# EAGLE schematic HP85disk_03 (EAGLE 9.2.2)

## Sheet 1 of 2
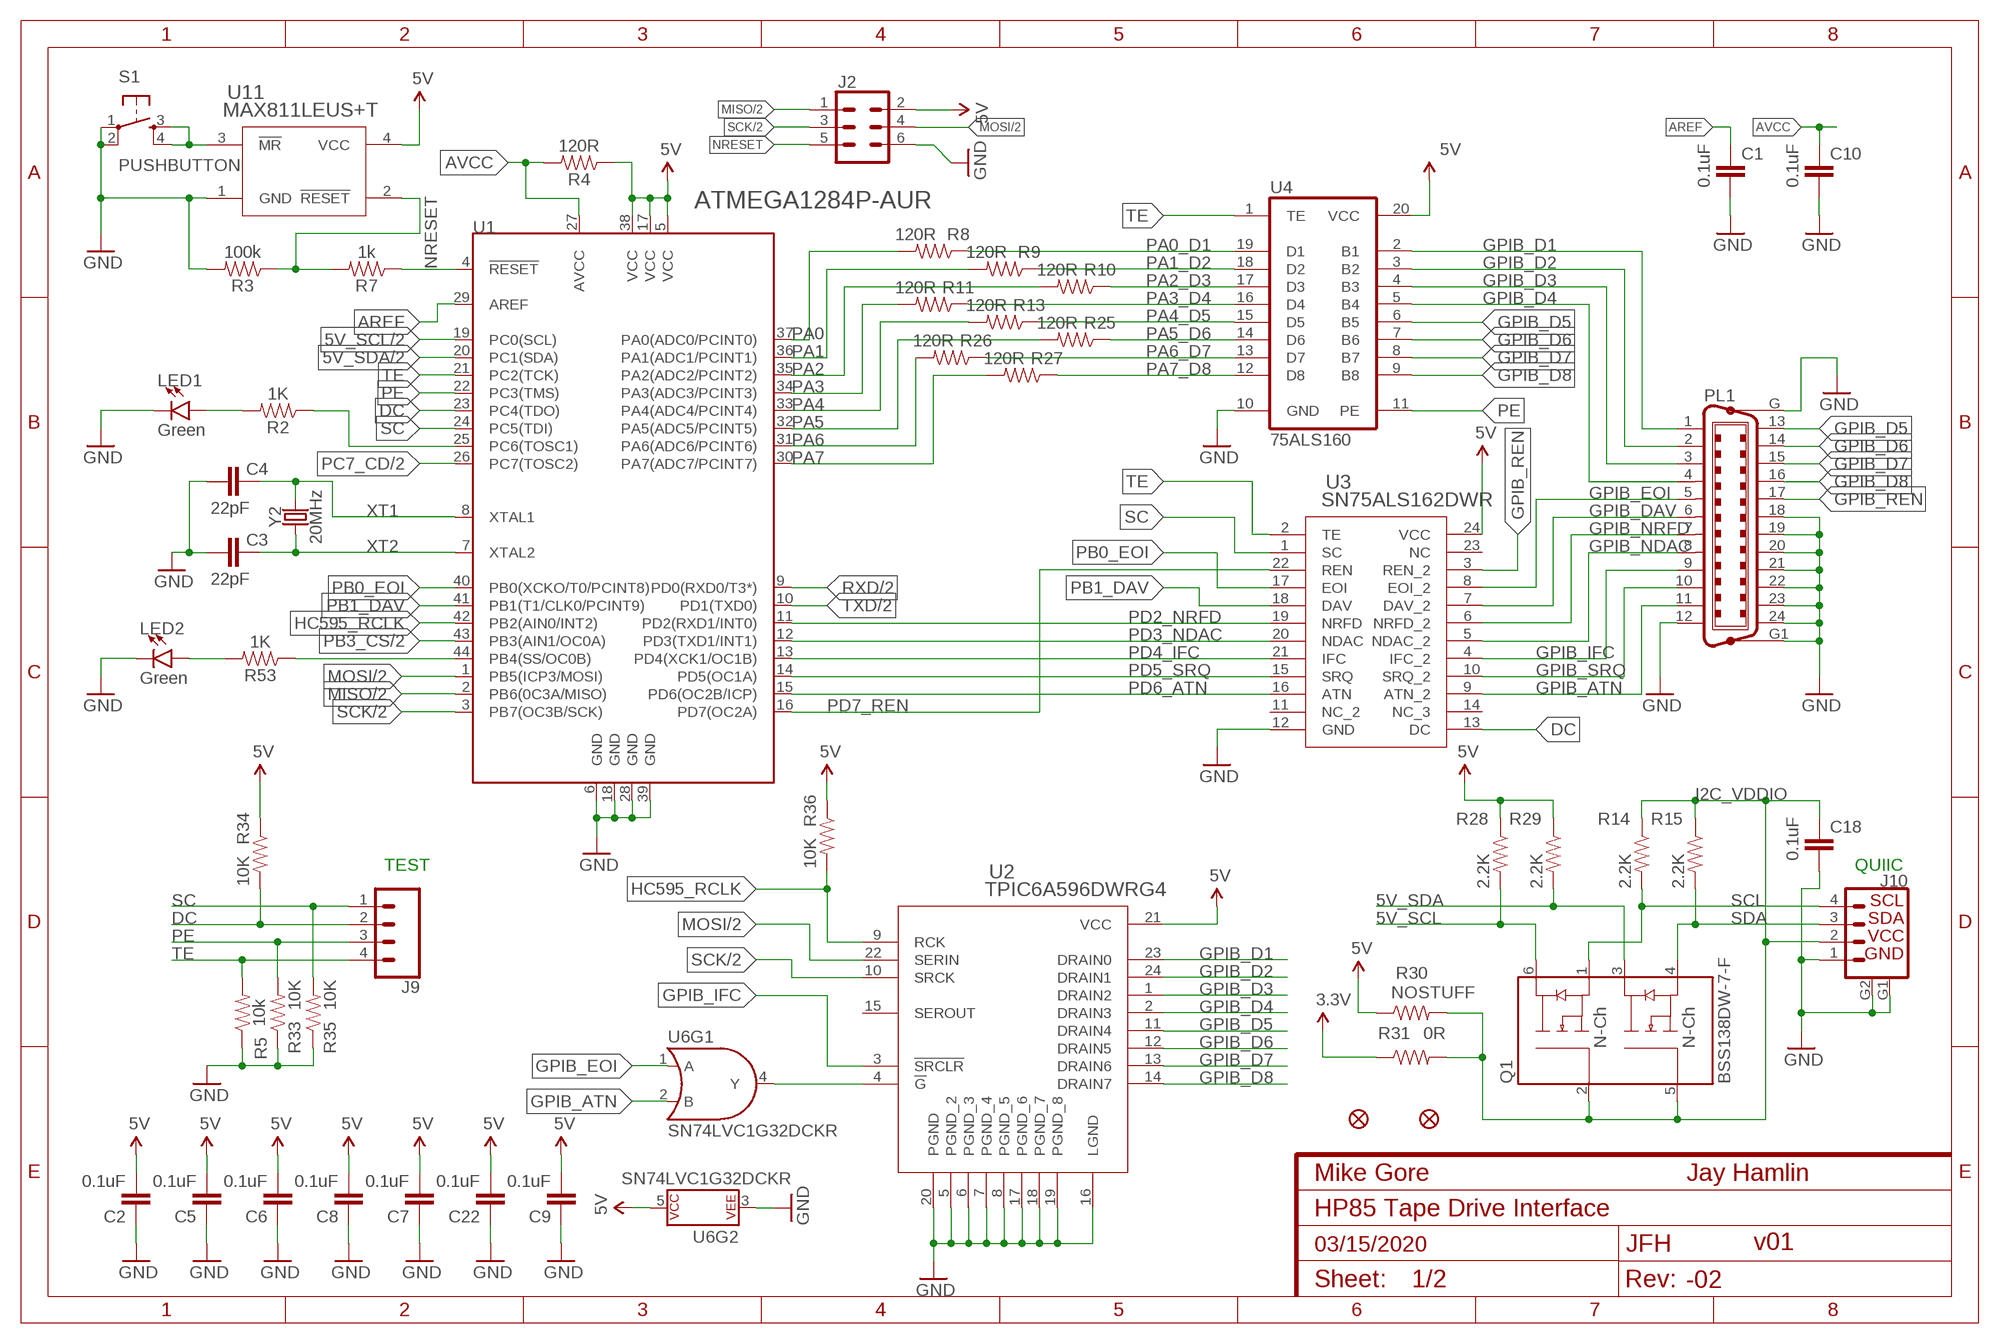
[diagram p0: schematic, sheet 1]

### Parts
C1  0.1uF  0.1UF-0603-25V-(+80/-20%)  [0603]
C2  0.1uF  0.1UF-0603-25V-(+80/-20%)  [0603]
C3  22pF  0.1UF-0603-25V-(+80/-20%)  [0603]
C4  22pF  0.1UF-0603-25V-(+80/-20%)  [0603]
C5  0.1uF  0.1UF-0603-25V-(+80/-20%)  [0603]
C6  0.1uF  0.1UF-0603-25V-(+80/-20%)  [0603]
C7  0.1uF  0.1UF-0603-25V-(+80/-20%)  [0603]
C8  0.1uF  0.1UF-0603-25V-(+80/-20%)  [0603]
C9  0.1uF  0.1UF-0603-25V-(+80/-20%)  [0603]
C10  0.1uF  0.1UF-0603-25V-(+80/-20%)  [0603]
C18  0.1uF  0.1UF-0603-25V-(+80/-20%)  [0603]
C22  0.1uF  0.1UF-0603-25V-(+80/-20%)  [0603]
J2  CONN_03X2_BIGPADSFEMALE_SMD  [2X3_SMD]
J9  CONN_041.27MM  [1X04_1.27MM]
J10  QWIIC_CONNECTORJS-1MM  [QUIIC_1X04_1MM_RA]
JP8  FIDUCIAL1X2  [FIDUCIAL-1X2]
JP9  FIDUCIAL1X2  [FIDUCIAL-1X2]
LED1  Green  LED1206  [LED-1206]
LED2  Green  LED1206  [LED-1206]
PL1  C24HP  [24HP]
Q1  BSS138DW-7-F  [SOT-363]
R2  1K  4.7KOHM-0603-1/10W-1%  [0603]
R3  100k  10KOHM-0603-1/10W-1%  [0603]
R4  120R  10KOHM-0603-1/10W-1%  [0603]
R5  10k  10KOHM-0603-1/10W-1%  [0603]
R7  1k  10KOHM-0603-1/10W-1%  [0603]
R8  120R  10KOHM-0603-1/10W-1%  [0603]
R9  120R  10KOHM-0603-1/10W-1%  [0603]
R10  120R  10KOHM-0603-1/10W-1%  [0603]
R11  120R  10KOHM-0603-1/10W-1%  [0603]
R13  120R  10KOHM-0603-1/10W-1%  [0603]
R14  2.2K  10KOHM-0603-1/10W-1%  [0603]
R15  2.2K  10KOHM-0603-1/10W-1%  [0603]
R25  120R  10KOHM-0603-1/10W-1%  [0603]
R26  120R  10KOHM-0603-1/10W-1%  [0603]
R27  120R  10KOHM-0603-1/10W-1%  [0603]
R28  2.2K  10KOHM-0603-1/10W-1%  [0603]
R29  2.2K  10KOHM-0603-1/10W-1%  [0603]
R30  NOSTUFF  10KOHM-0603-1/10W-1%  [0603]
R31  0R  10KOHM-0603-1/10W-1%  [0603]
R33  10K  10KOHM-0603-1/10W-1%  [0603]
R34  10K  10KOHM-0603-1/10W-1%  [0603]
R35  10K  10KOHM-0603-1/10W-1%  [0603]
R36  10K  10KOHM-0603-1/10W-1%  [0603]
R53  1K  4.7KOHM-0603-1/10W-1%  [0603]
S1  PUSHBUTTON  SWITCH_SPST_4_PINSQUARE  [TACTILE-SWITCH-SMD]
U1  ATMEGA1284P-AUR  ATMEGA1284AUTQFP-44  [TQFP44]
U2  TPIC6A596DWRG4  [DW24]
U3  SN75ALS162DWR  [DW24]
U4  75ALS160  75160SO  [SO20L]
U6  SN74LVC1G32DCKR  74LVC32DBV  [SOT23-5]
U11  MAX811LEUS+T  MAX811TEUS+T  [21-0052F]
Y2  20MHz  CRYSTAL-16MHZSMD-5X3.2  [CRYSTAL-SMD-5X3.2-4PAD]

### Nets
3.3V: R31.1 ; also sheet 2
5V: C2.2 C5.2 C6.2 C7.2 C8.2 C9.2 C22.2 J2.2 R4.1 R28.1 R29.1 R30.1 R34.1 R36.1 U1.5(VCC) U1.17(VCC) U1.38(VCC) U2.21(VCC) U3.24(VCC) U4.20(VCC) U6.5(P$V+) U11.4(VCC) ; also sheet 2
5V_SCL: Q1.6(D1) R28.2 U1.19(PC0(SCL)) ; also sheet 2
5V_SDA: Q1.3(D2) R29.2 U1.20(PC1(SDA)) ; also sheet 2
AREF: C1.1 U1.29(AREF)
AVCC: C10.1 R4.2 U1.27(AVCC)
DC: J9.2 R34.2 U1.23(PC4(TDO)) U3.13(DC)
GND: C1.2 C2.1 C3.1 C4.1 C5.1 C6.1 C7.1 C8.1 C9.1 C10.2 C18.2 C22.1 J2.6 J10.1 J10.G1 J10.G2 LED1.C LED2.C PL1.12 PL1.18 PL1.19 PL1.20 PL1.21 PL1.22 PL1.23 PL1.24 PL1.G PL1.G1 R3.2 R5.1 R33.1 R35.1 S1.1 S1.2 U1.6(GND) U1.18(GND) U1.28(GND) U1.39(GND) U2.5(PGND_2) U2.6(PGND_3) U2.7(PGND_4) U2.8(PGND_5) U2.16(LGND) U2.17(PGND_6) U2.18(PGND_7) U2.19(PGND_8) U2.20(PGND) U3.12(GND) U4.10(GND) U6.3(P$V-) U11.1(GND) ; also sheet 2
GPIB_ATN: PL1.11 U3.9(ATN_2) U6.2(B)
GPIB_D1: PL1.1 U2.23(DRAIN0) U4.2(B1)
GPIB_D2: PL1.2 U2.24(DRAIN1) U4.3(B2)
GPIB_D3: PL1.3 U2.1(DRAIN2) U4.4(B3)
GPIB_D4: PL1.4 U2.2(DRAIN3) U4.5(B4)
GPIB_D5: PL1.13 U2.11(DRAIN4) U4.6(B5)
GPIB_D6: PL1.14 U2.12(DRAIN5) U4.7(B6)
GPIB_D7: PL1.15 U2.13(DRAIN6) U4.8(B7)
GPIB_D8: PL1.16 U2.14(DRAIN7) U4.9(B8)
GPIB_DAV: PL1.6 U3.7(DAV_2)
GPIB_EOI: PL1.5 U3.8(EOI_2) U6.1(A)
GPIB_IFC: PL1.9 U2.3(!SRCLR) U3.4(IFC_2)
GPIB_NDAC: PL1.8 U3.5(NDAC_2)
GPIB_NRFD: PL1.7 U3.6(NRFD_2)
GPIB_REN: PL1.17 U3.3(REN_2)
GPIB_SRQ: PL1.10 U3.10(SRQ_2)
HC595_RCLK: R36.2 U1.42(PB2(AIN0/INT2)) U2.9(RCK)
I2C_VDDIO: C18.1 J10.2 Q1.2(G1) Q1.5(G2) R14.1 R15.1 R30.2 R31.2
MISO: J2.1 U1.2(PB6(0C3A/MISO)) ; also sheet 2
MOSI: J2.4 U1.1(PB5(ICP3/MOSI)) U2.22(SERIN) ; also sheet 2
N$2: R2.1 U1.25(PC6(TOSC1))
N$6: U2.4(!G) U6.4(Y)
N$8: S1.3 S1.4 U11.3(!MR)
N$10: R53.1 U1.44(PB4(SS/OC0B))
N$12: R3.1 R7.2 U11.2(!RESET)
N$21: LED1.A R2.2
N$22: LED2.A R53.2
NRESET: J2.5 R7.1 U1.4(!RESET)
PA0: R8.2 U1.37(PA0(ADC0/PCINT0))
PA0_D1: R8.1 U4.19(D1)
PA1: R9.2 U1.36(PA1(ADC1/PCINT1))
PA1_D2: R9.1 U4.18(D2)
PA2: R10.2 U1.35(PA2(ADC2/PCINT2))
PA2_D3: R10.1 U4.17(D3)
PA3: R11.2 U1.34(PA3(ADC3/PCINT3))
PA3_D4: R11.1 U4.16(D4)
PA4: R13.2 U1.33(PA4(ADC4/PCINT4))
PA4_D5: R13.1 U4.15(D5)
PA5: R25.2 U1.32(PA5(ADC5/PCINT5))
PA5_D6: R25.1 U4.14(D6)
PA6: R26.2 U1.31(PA6(ADC6/PCINT6))
PA6_D7: R26.1 U4.13(D7)
PA7: R27.2 U1.30(PA7(ADC7/PCINT7))
PA7_D8: R27.1 U4.12(D8)
PB0_EOI: U1.40(PB0(XCKO/T0/PCINT8)) U3.17(EOI)
PB1_DAV: U1.41(PB1(T1/CLK0/PCINT9)) U3.18(DAV)
PB3_CS: U1.43(PB3(AIN1/OC0A)) ; also sheet 2
PC7_CD: U1.26(PC7(TOSC2)) ; also sheet 2
PD2_NRFD: U1.11(PD2(RXD1/INT0)) U3.19(NRFD)
PD3_NDAC: U1.12(PD3(TXD1/INT1)) U3.20(NDAC)
PD4_IFC: U1.13(PD4(XCK1/OC1B)) U3.21(IFC)
PD5_SRQ: U1.14(PD5(OC1A)) U3.15(SRQ)
PD6_ATN: U1.15(PD6(OC2B/ICP)) U3.16(ATN)
PD7_REN: U1.16(PD7(OC2A)) U3.22(REN)
PE: J9.3 R33.2 U1.22(PC3(TMS)) U4.11(PE)
RXD: U1.9(PD0(RXD0/T3*)) ; also sheet 2
SC: J9.1 R35.2 U1.24(PC5(TDI)) U3.1(SC)
SCK: J2.3 U1.3(PB7(OC3B/SCK)) U2.10(SRCK) ; also sheet 2
SCL: J10.4 Q1.1(S1) R14.2
SDA: J10.3 Q1.4(S2) R15.2
TE: J9.4 R5.2 U1.21(PC2(TCK)) U3.2(TE) U4.1(TE)
TXD: U1.10(PD1(TXD0)) ; also sheet 2
XT1: C4.2 U1.8(XTAL1) Y2.3
XT2: C3.2 U1.7(XTAL2) Y2.1
Unconnected: U2.15(SEROUT) U3.11(NC_2) U3.14(NC_3) U3.23(NC)

### Notes on the sheet
- TEST | QUIIC
- v01

## Sheet 2 of 2
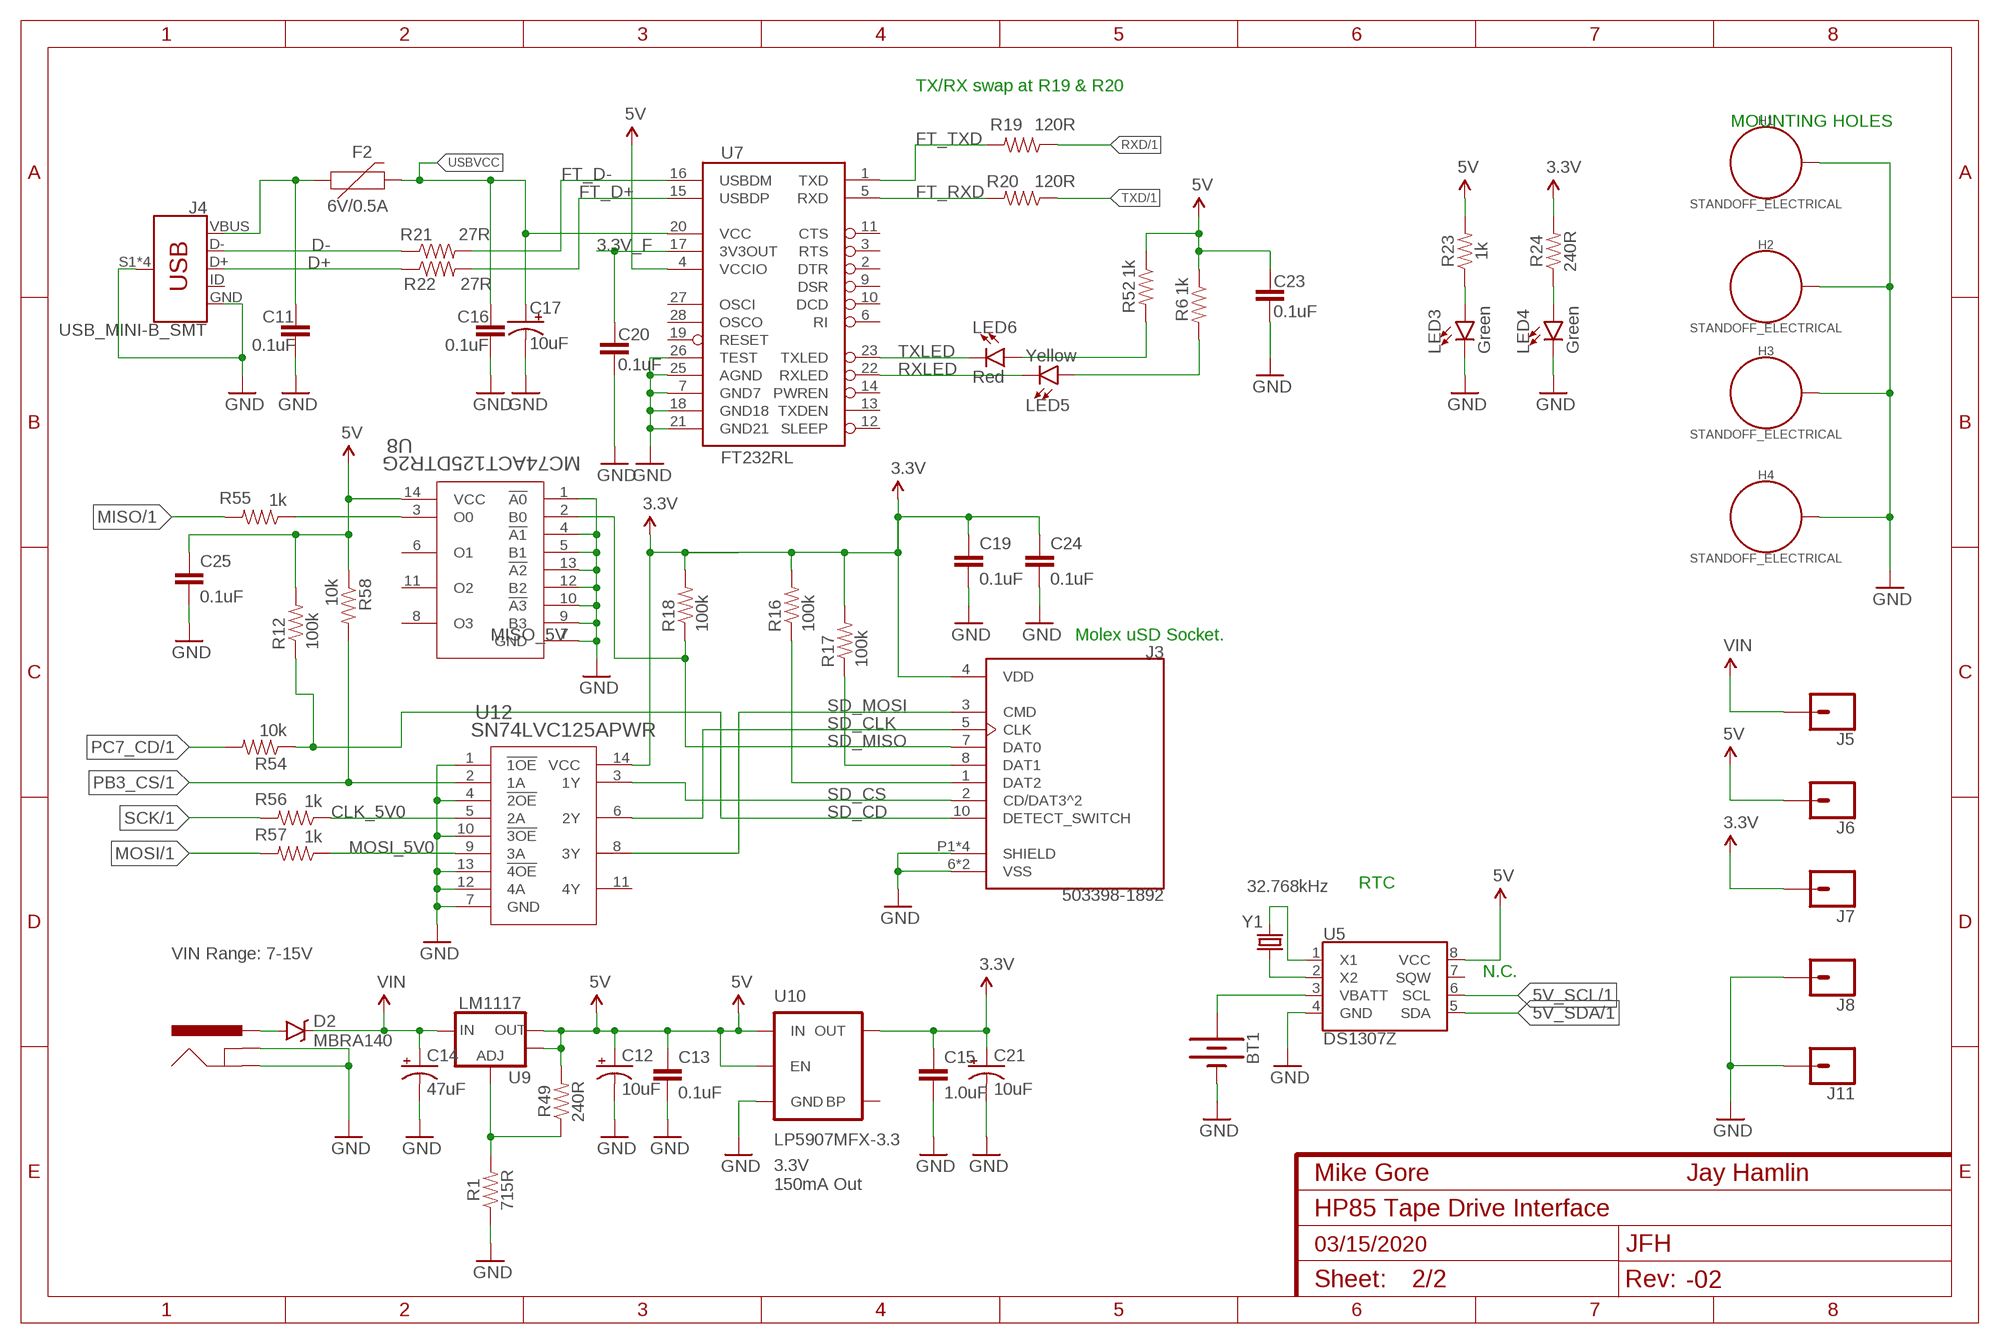
[diagram p1: schematic, sheet 2]

### Parts
BT1  BATTERY-12MM_PTH  [BATTCON_12MM_PTH]
C11  0.1uF  0.1UF-0603-25V-(+80/-20%)  [0603]
C12  10uF  10UF-POLAR-EIA3216-16V-10%(TANT)  [EIA3216]
C13  0.1uF  0.1UF-0603-25V-(+80/-20%)  [0603]
C14  47uF  47UF-POLAR-PANASONIC_D-35V-20%  [PANASONIC_D]
C15  1.0uF  1.0UF-0603-16V-10%  [0603]
C16  0.1uF  0.1UF-0603-25V-(+80/-20%)  [0603]
C17  10uF  10UF-POLAR-EIA3216-16V-10%(TANT)  [EIA3216]
C19  0.1uF  0.1UF-0603-25V-(+80/-20%)  [0603]
C20  0.1uF  0.1UF-0603-25V-(+80/-20%)  [0603]
C21  10uF  10UF-POLAR-EIA3216-16V-10%(TANT)  [EIA3216]
C23  0.1uF  0.1UF-0603-25V-(+80/-20%)  [0603]
C24  0.1uF  0.1UF-0603-25V-(+80/-20%)  [0603]
C25  0.1uF  0.1UF-0603-25V-(+80/-20%)  [0603]
D2  MBRA140  [SMA-DIODE]
F2  6V/0.5A  PTC-HALF_AMP  [1206]
H1  STANDOFF_ELECTRICAL  [STANDOFF-ELECTRICAL]
H2  STANDOFF_ELECTRICAL  [STANDOFF-ELECTRICAL]
H3  STANDOFF_ELECTRICAL  [STANDOFF-ELECTRICAL]
H4  STANDOFF_ELECTRICAL  [STANDOFF-ELECTRICAL]
J1  POWER_JACKSUPER_BOMB_DIGITY  [POWER_JACK_SMD_OVERPASTE_SUPER_BOMB_DIGITY]
J3  503398-1892  [MOLEX_503398-1892]
J4  USB_MINI-B_SMT  [USB-MINIB]
J5  CONN_01  [1X01]
J6  CONN_01  [1X01]
J7  CONN_01  [1X01]
J8  CONN_01  [1X01]
J11  CONN_01  [1X01]
LED3  Green  LED1206  [LED-1206]
LED4  Green  LED1206  [LED-1206]
LED5  Yellow  LED1206  [LED-1206]
LED6  Red  LED1206  [LED-1206]
R1  715R  715OHM-0603-1/10W-1%  [0603]
R6  1k  1KOHM-0603-1/10W-1%  [0603]
R12  100k  100KOHM-1/10W-1%(0603)  [0603-RES]
R16  100k  100KOHM-1/10W-1%(0603)  [0603-RES]
R17  100k  100KOHM-1/10W-1%(0603)  [0603-RES]
R18  100k  100KOHM-1/10W-1%(0603)  [0603-RES]
R19  120R  1KOHM-0603-1/10W-1%  [0603]
R20  120R  1KOHM-0603-1/10W-1%  [0603]
R21  27R  27OHM-0603-1/10W-1%  [0603]
R22  27R  27OHM-0603-1/10W-1%  [0603]
R23  1k  4.7KOHM-0603-1/10W-1%  [0603]
R24  240R  4.7KOHM-0603-1/10W-1%  [0603]
R49  240R  240OHM-0603-1/10W-1%  [0603]
R52  1k  1KOHM-0603-1/10W-1%  [0603]
R54  10k  100KOHM-1/10W-1%(0603)  [0603-RES]
R55  1k  100KOHM-1/10W-1%(0603)  [0603-RES]
R56  1k  100KOHM-1/10W-1%(0603)  [0603-RES]
R57  1k  100KOHM-1/10W-1%(0603)  [0603-RES]
R58  10k  100KOHM-1/10W-1%(0603)  [0603-RES]
U5  DS1307Z  [SO08-0.15]
U7  FT232RL  FT232RLSSOP  [SSOP28DB]
U8  MC74ACT125DTR2G  [TSSOP14_4P50X5P10]
U9  LM1117  V_REG_LM1117ALT1  [SOT223-ALT1]
U10  LP5907MFX-3.3  MIC52053.3V  [SOT23-5]
U12  SN74LVC125APWR  [PW14]
Y1  32.768kHz  CRYSTAL-32.768KHZSMD-2X6  [CRYSTAL-SMD-2X6-CYL]

### Nets
3.3V: C15.1 C19.1 C21.+ C24.1 J3.4(VDD) J7.1 R16.2 R17.2 R18.2 R24.2 U10.5(OUT) U12.14(VCC) ; also sheet 1
3.3V_F: C20.1 U7.17(3V3OUT)
5V: C12.+ C13.1 C23.1 C25.1 J6.1 R6.1 R12.2 R23.2 R49.2 R52.1 R58.1 U5.8(VCC) U7.4(VCCIO) U8.14(VCC) U9.2(OUT) U9.4(OUT) U10.1(IN) U10.3(EN) ; also sheet 1
5V_SCL: U5.6(SCL) ; also sheet 1
5V_SDA: U5.5(SDA) ; also sheet 1
CLK_5V0: R56.1 U12.5(2A)
D+: J4.D+ R22.1
D-: J4.D- R21.1
FT_D+: R22.2 U7.15(USBDP)
FT_D-: R21.2 U7.16(USBDM)
FT_RXD: R20.2 U7.5(RXD)
FT_TXD: R19.2 U7.1(TXD)
GND: BT1.GND(-) C11.2 C12.- C13.2 C14.- C15.2 C16.2 C17.- C19.2 C20.2 C21.- C23.2 C24.2 C25.2 H1.P1 H2.P1 H3.P1 H4.P1 J1.GND(GNDBREAK) J1.P$4(GND) J3.6(VSS) J3.9(VSS) J3.P1(SHIELD) J3.P2(SHIELD) J3.P3(SHIELD) J3.P4(SHIELD) J4.GND J4.S1(SHIELD) J4.S2(SHIELD) J4.S3(SHIELD) J4.S4(SHIELD) J8.1 J11.1 LED3.C LED4.C R1.1 U5.4(GND) U7.7(GND7) U7.18(GND18) U7.21(GND21) U7.25(AGND) U7.26(TEST) U8.1(!A0) U8.4(!A1) U8.5(B1) U8.7(GND) U8.9(B3) U8.10(!A3) U8.12(B2) U8.13(!A2) U10.2(GND) U12.1(!1OE) U12.4(!2OE) U12.7(GND) U12.10(!3OE) U12.12(4A) U12.13(!4OE) ; also sheet 1
MISO: R55.2 ; also sheet 1
MISO_5V: R55.1 U8.3(O0)
MOSI: R57.2 ; also sheet 1
MOSI_5V0: R57.1 U12.9(3A)
N$1: R1.2 R49.1 U9.1(ADJ)
N$5: LED6.A R52.2
N$7: LED3.A R23.1
N$9: LED5.A R6.2
N$11: J3.8(DAT1) R17.1
N$13: J3.1(DAT2) R16.1
N$16: U5.1(X1) Y1.X2
N$17: BT1.VCC@1(+) U5.3(VBATT)
N$18: U5.2(X2) Y1.X1
N$19: LED4.A R24.1
PB3_CS: R58.2 U12.2(1A) ; also sheet 1
PC7_CD: R54.2 ; also sheet 1
PWRIN1: D2.A J1.VIN0(PWR)
RXD: R19.1 ; also sheet 1
RXLED: LED5.C U7.22(RXLED)
SCK: R56.2 ; also sheet 1
SD_CD: J3.10(DETECT_SWITCH) R12.1 R54.1
SD_CLK: J3.5(CLK) U12.6(2Y)
SD_CS: J3.2(CD/DAT3^2) U12.3(1Y)
SD_MISO: J3.7(DAT0) R18.1 U8.2(B0)
SD_MOSI: J3.3(CMD) U12.8(3Y)
TXD: R20.1 ; also sheet 1
TXLED: LED6.C U7.23(TXLED)
USBVCC: C16.1 C17.+ F2.2 U7.20(VCC)
VIN: C14.+ D2.C J5.1 U9.3(IN)
VUSB1: C11.1 F2.1 J4.VBUS
Unconnected: J4.ID U5.7(SQW) U7.2(DTR) U7.3(RTS) U7.6(RI) U7.9(DSR) U7.10(DCD) U7.11(CTS) U7.12(SLEEP) U7.13(TXDEN) U7.14(PWREN) U7.19(RESET) U7.27(OSCI) U7.28(OSCO) U8.6(O1) U8.8(O3) U8.11(O2) U10.4(BP) U12.11(4Y)

### Notes on the sheet
- TX/RX swap at R19 & R20
- MOUNTING HOLES
- Molex uSD Socket.
- RTC
- VIN Range: 7-15V
- N.C.
- 3.3V
  150mA Out

## Library data of the parts
BT1 = SparkFun-Batteries:BATTERY: Battery - Single Cell A variety of battery chemistries, sizes, and footprints. Device List: 20MM_PTH - Coin Cell Battery Holder - 20mm (PTH) <https://www.sparkfun.com/products/783> 12MM_SMD - Coin Cell Battery Holder - 12mm (SMD) <https://www.sparkfun.com/products/10592> 12MM_PTH - Coin Cell Battery Holder - 12mm (PTH) <https://www.sparkfun.com/products/7948> 20MM_SMD - 20mm Coin Cell Battery Holder (SMD) (2 legs) Used on the Big Time Watch Kit <https://www.sparkfun.com/products/11734> 20MM_SMD_4LEGS - Coin Cell Battery Holder - 20mm (SMD) <https://www.sparkfun.com/products/11892> 20MM_SMD_4LEGS_OVERPASTE - Coin Cell Battery Holder - 20mm (SMD) <https://www.sparkfun.com/products/11892> (Over-paste on the legs) 24.5MM_PTH - Coin Cell Battery Holder - 24.5mm (PTH) <https://www.sparkfun.com/products/8863> 9V - 9V Battery Holder - PC Mount Used on the SparkFun SparkPunk Sound Kit <https://www.sparkfun.com/products/11177> and SparkFun SparkPunk Sequencer Kit <https://www.sparkfun.com/products/12707> 18650 - Battery Holder - 18650 (PTH) <https://www.sparkfun.com/products/13113> AA - Battery Holder - 1xAA (PTH) <https://www.sparkfun.com/products/7949> AAA - Battery Holder - 1xAAA (PTH) <https://www.sparkfun.com/products/12718> AA_KIT - Battery Holder - 1xAA (PTH) <https://www.sparkfun.com/products/7949> Special kit package - pads only have exposed copper on one side of the board. AAA_KIT - Battery Holder - 1xAAA (PTH) <https://www.sparkfun.com/products/12718> Special kit package - pads only have exposed copper on one side of the board.; PROD_ID: BATT-08315; SF_SKU: PRT-07948
C1 C9-C11 C13 C16 C18-C20 C22-C25 = SparkFun-Capacitors:0.1UF: 0.1µF ceramic capacitors A capacitor is a passive two-terminal electrical component used to store electrical energy temporarily in an electric field.; PROD_ID: CAP-00810
C2 C5-C8 = SparkFun-Capacitors:0.1UF: 0.1µF ceramic capacitors A capacitor is a passive two-terminal electrical component used to store electrical energy temporarily in an electric field.; PROD_ID: CAP-00810; SPICEPREFIX: C
C3 C4 = SparkFun-Capacitors:0.1UF: 0.1µF ceramic capacitors A capacitor is a passive two-terminal electrical component used to store electrical energy temporarily in an electric field.; PROD_ID: CAP-00810; VALUE: 0.1uF
C12 C17 C21 = SparkFun-Capacitors:10UF-POLAR: 10.0µF polarized capacitors A capacitor is a passive two-terminal electrical component used to store electrical energy temporarily in an electric field.; PROD_ID: CAP-00811
C14 = SparkFun-Capacitors:47UF-POLAR: 47µF polarized capacitors A capacitor is a passive two-terminal electrical component used to store electrical energy temporarily in an electric field.; PROD_ID: CAP-08478
C15 = SparkFun-Capacitors:1.0UF: 1µF ceramic capacitors A capacitor is a passive two-terminal electrical component used to store electrical energy temporarily in an electric field.; PROD_ID: CAP-00868
D2 = SparkFun-DiscreteSemi:MBRA140: 40V, 1A Schottky rectifier SMA/DO-214AC package DIO-08053; PROD_ID: DIO-08053
F2 = SparkFun-Fuses:PTC: Resettable Fuse PTC Resettable Fuse. Really a resistor with a postive temperature coefficient who's resistance increases dramatically with an increase in temperature. When heated by the power passing through the resistance rises causing the current to be limited, protecting the circuit. When a PTC cools back down it resumes conducting letting the circuit turn back on.; PROD_ID: RES-08585
H1-H4 = SparkFun-Hardware:STANDOFF_ELECTRICAL: Stand Off Drill holes with an electrical connection. For example, use these to ground your board to a chassis. Example SparkFun Products Screw - Phillips Head (1/4", 4-40, 10 pack) <https://www.sparkfun.com/products/10453> (PRT-10453) Screw - Phillips Head (1/2", 4-40, 10 pack) <https://www.sparkfun.com/products/10452> (PRT-10452) Screw - Phillips Head (3/4", 4-40, 10 pack) <https://www.sparkfun.com/products/10451> (PRT-10451) Screw - Phillips Head (1", 4-40, 10 pack) <https://www.sparkfun.com/products/10450> (PRT-10450)
J1 = Testing:POWER_JACK: Power Jack This is the standard 5.5mm barrel jack for power. The PTH is the most common, proven, reliable, footprint. All others are experimental. The Slot footprint only works if the mill layer is transmitted to the PCB fab house so be warned. Spark Fun Electronics SKU : PRT-00119. Mating wall wart : TOL-00298 (and others); PROD_ID: CONN-08106
J2 = JaysOWL_Library:CONN_03X2_BIGPADS: Multi connection point. Often used as Generic Header-pin footprint for 0.1 inch spaced/style header connections You can populate with any combo of single row headers, but if you'd like an exact match, check these: Header - 2x3 (Male, 0.1") <https://www.sparkfun.com/products/12807> (PRT-12807) Header - 2x3 (Female, 0.1") <https://www.sparkfun.com/products/13010> (PRT-13010) 2x3 Pin Shrouded Header <https://www.sparkfun.com/products/10877> (PRT-10877) On any of the 0.1 inch spaced packages, you can populate with these: Break Away Headers - Straight <https://www.sparkfun.com/products/116> (PRT-00116) Break Away Male Headers - Right Angle <https://www.sparkfun.com/products/553> (PRT-00553) Female Headers <https://www.sparkfun.com/products/115> (PRT-00115) Break Away Headers - Machine Pin <https://www.sparkfun.com/products/117> (PRT-00117) Break Away Female Headers - Swiss Machine Pin <https://www.sparkfun.com/products/743> (PRT-00743) Special note: the shrouded connector mates well with our 3x2 ribbon cables: Ribbon Crimp Connector - 6-pin (2x3, Female) <https://www.sparkfun.com/products/10651> (PRT-10651) Ribbon Cable - 6 wire (15ft) <https://www.sparkfun.com/products/10646> (PRT-10646); PROD_ID: CONN-11290
J3 = JaysOWL_Library:503398-1892: 1.10mm Pitch microSD Memory Card Connector, Normal Mount Surface Mount, Push-Push Type, 1.28mm Height; DESCRIPTION: 9 _8 + 1_ Position Card Connector microSD™ Surface Mount, Right Angle Gold; DIGI-KEY_PART_NUMBER: WM11190CT-ND; DIGI-KEY_PURCHASE_URL: https://www.digikey.com/product-detail/en/molex/5033981892/WM11190CT-ND/5230912?utm_source=snapeda&utm_medium=aggregator&utm_campaign=symbol; MF: Molex; MP: 5033981892; PACKAGE: None
J4 = JaysOWL_Library:USB_MINI-B: USB type Mini-B Connector Breaks out 5th pin, and includes shield pins if needed. SparkFun Products: SparkFun FTDI Basic Breakout <https://www.sparkfun.com/products/9716> SparkFun XBee Explorer USB <https://www.sparkfun.com/products/11812> SparkFun Redboard <https://www.sparkfun.com/products/12757>; PROD_ID: CONN-08193; SF_ID: PRT-00587
J5-J8 J11 = SparkFun-Connectors:CONN_01: Single connection point. Often used as Generic Header-pin footprint for 0.1 inch spaced/style header connections On any of the 0.1 inch spaced packages, you can populate with these: Break Away Headers - Straight <https://www.sparkfun.com/products/116> (PRT-00116) Break Away Male Headers - Right Angle <https://www.sparkfun.com/products/553> (PRT-00553) Female Headers <https://www.sparkfun.com/products/115> (PRT-00115) Break Away Headers - Machine Pin <https://www.sparkfun.com/products/117> (PRT-00117) Break Away Female Headers - Swiss Machine Pin <https://www.sparkfun.com/products/743> (PRT-00743) This device is also useful as a general connection point to wire up your design to another part of your project. Our various solder wires solder well into these plated through hole pads. Hook-Up Wire - Assortment (Stranded, 22 AWG) <https://www.sparkfun.com/products/11375> (PRT-11375) Hook-Up Wire - Assortment (Solid Core, 22 AWG) <https://www.sparkfun.com/products/11367> (PRT-11367) View the entire wire category on our website here <https://www.sparkfun.com/categories/141> Special notes: SMTSO-256-ET is a "flush mount" nut for a 4-40 screw. We mostly use this on specialty testbeds; it is a nice way to connect hardware to your PCB at an adjustable hieght. Also note, the SNAP packages are for using a snappable style connector. We sell a baggie of snaps and they are also used on two LilyPad designs: Snap Assortment - 30 pack (male and female) <https://www.sparkfun.com/products/11347> (DEV-11347) LilyPad Arduino SimpleSnap <https://www.sparkfun.com/products/10941> (DEV-10941) LilyPad SimpleSnap Protoboard <https://www.sparkfun.com/products/10940> (DEV-10940)
J9 = SparkFun-Connectors:CONN_04: Multi connection point. Often used as Generic Header-pin footprint for 0.1 inch spaced/style header connections On any of the 0.1 inch spaced packages, you can populate with these: Break Away Headers - Straight <https://www.sparkfun.com/products/116> (PRT-00116) Break Away Male Headers - Right Angle <https://www.sparkfun.com/products/553> (PRT-00553) Female Headers <https://www.sparkfun.com/products/115> (PRT-00115) Break Away Headers - Machine Pin <https://www.sparkfun.com/products/117> (PRT-00117) Break Away Female Headers - Swiss Machine Pin <https://www.sparkfun.com/products/743> (PRT-00743) For SCREWTERMINALS and SPRING TERMINALS visit here: Screw Terimnals on SparkFun.com <https://www.sparkfun.com/search/results?term=Screw+Terminals> (5mm/3.5mm/2.54mm spacing) This device is also useful as a general connection point to wire up your design to another part of your project. Our various solder wires solder well into these plated through hole pads. Hook-Up Wire - Assortment (Stranded, 22 AWG) <https://www.sparkfun.com/products/11375> (PRT-11375) Hook-Up Wire - Assortment (Solid Core, 22 AWG) <https://www.sparkfun.com/products/11367> (PRT-11367) View the entire wire category on our website here <https://www.sparkfun.com/categories/141> Special notes: Molex polarized connector foot print use with SKU : PRT-08231 with associated crimp pins and housings. 1MM SMD Version SKU: PRT-10208
J10 = JaysOWL_Library:QWIIC_CONNECTOR: SparkFun I2C Standard Qwiic Connector An SMD 1mm pitch JST connector makes it easy and quick (get it? Qwiic?) to connect I2C devices to each other. The Qwiic system <http://www.sparkfun.com/qwiic> enables fast and solderless connection between popular platforms and various sensors and actuators. We carry 200mm <https://www.sparkfun.com/products/14204>, 100mm <https://www.sparkfun.com/products/14205>, 50mm <https://www.sparkfun.com/products/14206>, and breadboard friendly <https://www.sparkfun.com/products/14207> Qwiic cables. We also offer 10 pcs strips <https://www.sparkfun.com/products/14323> the SMD connectors.
JP8 JP9 = SparkFun:FIDUCIAL: Fiducial Alignment Points Various fiducial points for machine vision alignment.
LED1-LED4 = SparkFun-LED:LED: LED (Generic) Standard schematic elements and footprints for 5mm, 3mm, 1206, and 0603 sized LEDs. Generic LEDs with no color specified.; PROD_ID: DIO-09910
LED5 = SparkFun-LED:LED: LED (Generic) Standard schematic elements and footprints for 5mm, 3mm, 1206, and 0603 sized LEDs. Generic LEDs with no color specified.; PROD_ID: DIO-09909
LED6 = SparkFun-LED:LED: LED (Generic) Standard schematic elements and footprints for 5mm, 3mm, 1206, and 0603 sized LEDs. Generic LEDs with no color specified.; PROD_ID: DIO-09912
PL1 = con-amp-champ:C24HP: CONNECTOR; OC_FARNELL: unknown; OC_NEWARK: unknown
Q1 = JaysOWL_Library:BSS138DW-7-F; BUILT_BY: EMA_UL_Team; MANUFACTURER_PART_NUMBER: BSS138DW-7-F; VENDOR: Diodes Inc
R1 = SparkFun-Resistors:715OHM: 715Ω resistor A resistor is a passive two-terminal electrical component that implements electrical resistance as a circuit element. Resistors act to reduce current flow, and, at the same time, act to lower voltage levels within circuits.; PROD_ID: RES-07850; VALUE: 715
R2 R23 R24 R53 = SparkFun-Resistors:4.7KOHM: 4.7kΩ resistor A resistor is a passive two-terminal electrical component that implements electrical resistance as a circuit element. Resistors act to reduce current flow, and, at the same time, act to lower voltage levels within circuits.; PROD_ID: RES-07857; VALUE: 4.7k
R3 R4 R7-R11 R13-R15 R25-R31 R33-R36 = SparkFun-Resistors:10KOHM: 10kΩ resistor A resistor is a passive two-terminal electrical component that implements electrical resistance as a circuit element. Resistors act to reduce current flow, and, at the same time, act to lower voltage levels within circuits.; PROD_ID: RES-00824; VALUE: 10k
R5 = SparkFun-Resistors:10KOHM: 10kΩ resistor A resistor is a passive two-terminal electrical component that implements electrical resistance as a circuit element. Resistors act to reduce current flow, and, at the same time, act to lower voltage levels within circuits.; PROD_ID: RES-00824
R6 R52 = SparkFun-Resistors:1KOHM: 1kΩ resistor A resistor is a passive two-terminal electrical component that implements electrical resistance as a circuit element. Resistors act to reduce current flow, and, at the same time, act to lower voltage levels within circuits.; PROD_ID: RES-07856
R12 R16-R18 = SparkFun-Resistors:100KOHM-1/10W-1%(0603): RES-07828; PROD_ID: RES-07828
R19 R20 = SparkFun-Resistors:1KOHM: 1kΩ resistor A resistor is a passive two-terminal electrical component that implements electrical resistance as a circuit element. Resistors act to reduce current flow, and, at the same time, act to lower voltage levels within circuits.; PROD_ID: RES-07856; VALUE: 1k
R21 R22 = SparkFun-Resistors:27OHM: 27Ω resistor A resistor is a passive two-terminal electrical component that implements electrical resistance as a circuit element. Resistors act to reduce current flow, and, at the same time, act to lower voltage levels within circuits.; PROD_ID: RES-09334; VALUE: 27
R49 = SparkFun-Resistors:240OHM: 240Ω resistor A resistor is a passive two-terminal electrical component that implements electrical resistance as a circuit element. Resistors act to reduce current flow, and, at the same time, act to lower voltage levels within circuits.; PROD_ID: RES-07849; VALUE: 240
R54-R58 = SparkFun-Resistors:100KOHM-1/10W-1%(0603): RES-07828; PROD_ID: RES-07828; VALUE: 100k
S1 = SparkFun-Electromechanical:SWITCH_SPST_4_PIN; PROD_ID: SWCH-08247
U1 = JaysOWL_Library:ATMEGA1284AU: ATMega1284 AU; PROD_ID: IC-11161; VALUE: 32U4
U2 = JaysOWL_Library:TPIC6A596DWRG4; BUILT_BY: EMA_UL_Team; MANUFACTURER: Texas Instruments; MANUFACTURER_PART_NUMBER: TPIC6A596DWRG4; VENDOR: Texas Instruments
U3 = JaysOWL_Library:SN75ALS162DWR; BUILT_BY: EMA_UL_Team; MANUFACTURER: Texas Instruments; MANUFACTURER_PART_NUMBER: SN75ALS162DWR; VENDOR: Vendor
U4 = JaysOWL_Library:75160: 75xxx DEVICE
U5 = SparkFun-Clocks:DS1307: Maxim DS1307 - I2C Real-time clock (RTC) The DS1307 serial real-time clock (RTC) is a low-power, full binary-coded decimal (BCD) clock/calendar plus 56 bytes of NV SRAM. Address and data are transferred serially through an I2C, bidirectional bus. The clock/calendar provides seconds, minutes, hours, day, date, month, and year information. SparkFun Products: Real Time Clock Module <https://www.sparkfun.com/products/12708> (BOB-12708) Datasheet <https://cdn.sparkfun.com/datasheets/BreakoutBoards/DS1307.pdf>; PROD_ID: IC-08138
U6 = JaysOWL_Library:74*32: Single OR gate IC POSITIVE-OR GATE 2-IN SC-70 SparkFun Products SparkFun Stepoko <https://www.sparkfun.com/products/13899> (ROB-13899) SparkFun LogicBlocks Kit <https://www.sparkfun.com/products/11006> (KIT-11006); PROD_ID: IC-10842
U7 = SparkFun-IC-Comms:FT232RL: FT232RL USB UART FT232RL 4th Generation USB UART (USB <-> Serial) Controller. Datasheet <http://www.sparkfun.com/datasheets/IC/FT232R_v104.pdf> SparkFun Products Component <https://www.sparkfun.com/products/650> (COM-00650) SparkFun RedBot Mainboard <https://www.sparkfun.com/products/12097> (ROB-12097) SparkFun FTDI Basic Breakout - 5V <https://www.sparkfun.com/products/9716> (DEV-09716) SparkFun FTDI Basic Breakout - 3.3V <https://www.sparkfun.com/products/9873> (DEV-09873) Bus Pirate - v3.6a <https://www.sparkfun.com/products/12942> (TOL-12942) SparkFun USB to Serial Breakout - FT232RL <https://www.sparkfun.com/products/12731> (BOB-12731) SparkFun PicoBoard <https://www.sparkfun.com/products/11888> (WIG-11888) SparkFun RFID USB Reader <https://www.sparkfun.com/products/9963> (SEN-09963) LilyPad FTDI Basic Breakout - 5V <https://www.sparkfun.com/products/10275> (DEV-10275) SparkFun Stepoko <https://www.sparkfun.com/products/13899> (ROB-13899); PROD_ID: IC-00870
U8 = JaysOWL_Library:MC74ACT125DTR2G; COPYRIGHT: Copyright (C) 2016 Accelerated Designs. All rights reserved; MANUFACTURER_PART_NUMBER: MC74ACT125DTR2G; VENDOR: ON Semiconductor
U9 = Testing:V_REG_LM1117: Voltage Regulator LM1117 Standard adjustable voltage regulator but in SMD form. Spark Fun Electronics SKU : COM-00595; PROD_ID: VREG-08170
U10 = SparkFun-PowerIC:MIC5205: MIC5205 150mA vreg 3.3V - VREG-00822 5V - VREG-00823; PROD_ID: VREG-00822
U11 = JaysOWL_Library:MAX811TEUS+T; BUILT_BY: EMA_UL_Team; COPYRIGHT: Copyright (C) 2018 Accelerated Designs. All rights reserved; MANUFACTURER_PART_NUMBER: MAX811TEUS+T; VENDOR: Maxim Integrated Products
U12 = JaysOWL_Library:SN74LVC125APWR; BUILT_BY: EMA_UL_Team; MANUFACTURER: Texas Instruments; MANUFACTURER_PART_NUMBER: SN74LVC125APWR; VENDOR: Texas Instruments
Y1 = SparkFun-Clocks:CRYSTAL-32.768KHZ: 32.768kHz Crystal Frequency: 32.768kHz Frequency Stability: ±20ppm Load Capacitance: 12.5pF (PTH-2X6 & SMD-3.2X1.5), 6pF (SMD-2X6) SparkFun Products: SparkFun BigTime Watch Kit <https://www.sparkfun.com/products/11734> SparkFun nRF52832 Breakout <https://www.sparkfun.com/products/13990> SparkFun Real Time Clock Module <https://www.sparkfun.com/products/12708>; PROD_ID: XTAL-07894
Y2 = SparkFun-Clocks:CRYSTAL-16MHZ: 16MHz Crystal Digikey Example <http://www.digikey.com/product-search/en?keywords=535-9122-1-ND> Frequency: 16MHz Frequency Stability: ±50ppm Frequency Tolerance: ±20ppm Load Capacitance: 18pF SparkFun Products: Pro Micro -5V/16MHz <https://www.sparkfun.com/products/12640> SparkFun Serial Enabled LCD Kit <https://www.sparkfun.com/products/10097>; PROD_ID: XTAL-08218; SF_ID: COM-00094; VALUE: 16MHz

## Net classes
0 default: width 0.102 mm, drill 0.305 mm, clearance 0.102 mm